# Altium schematic sheet POWER_SYS.SchDoc
size C; SheetNumber: 4; SheetTotal: 24
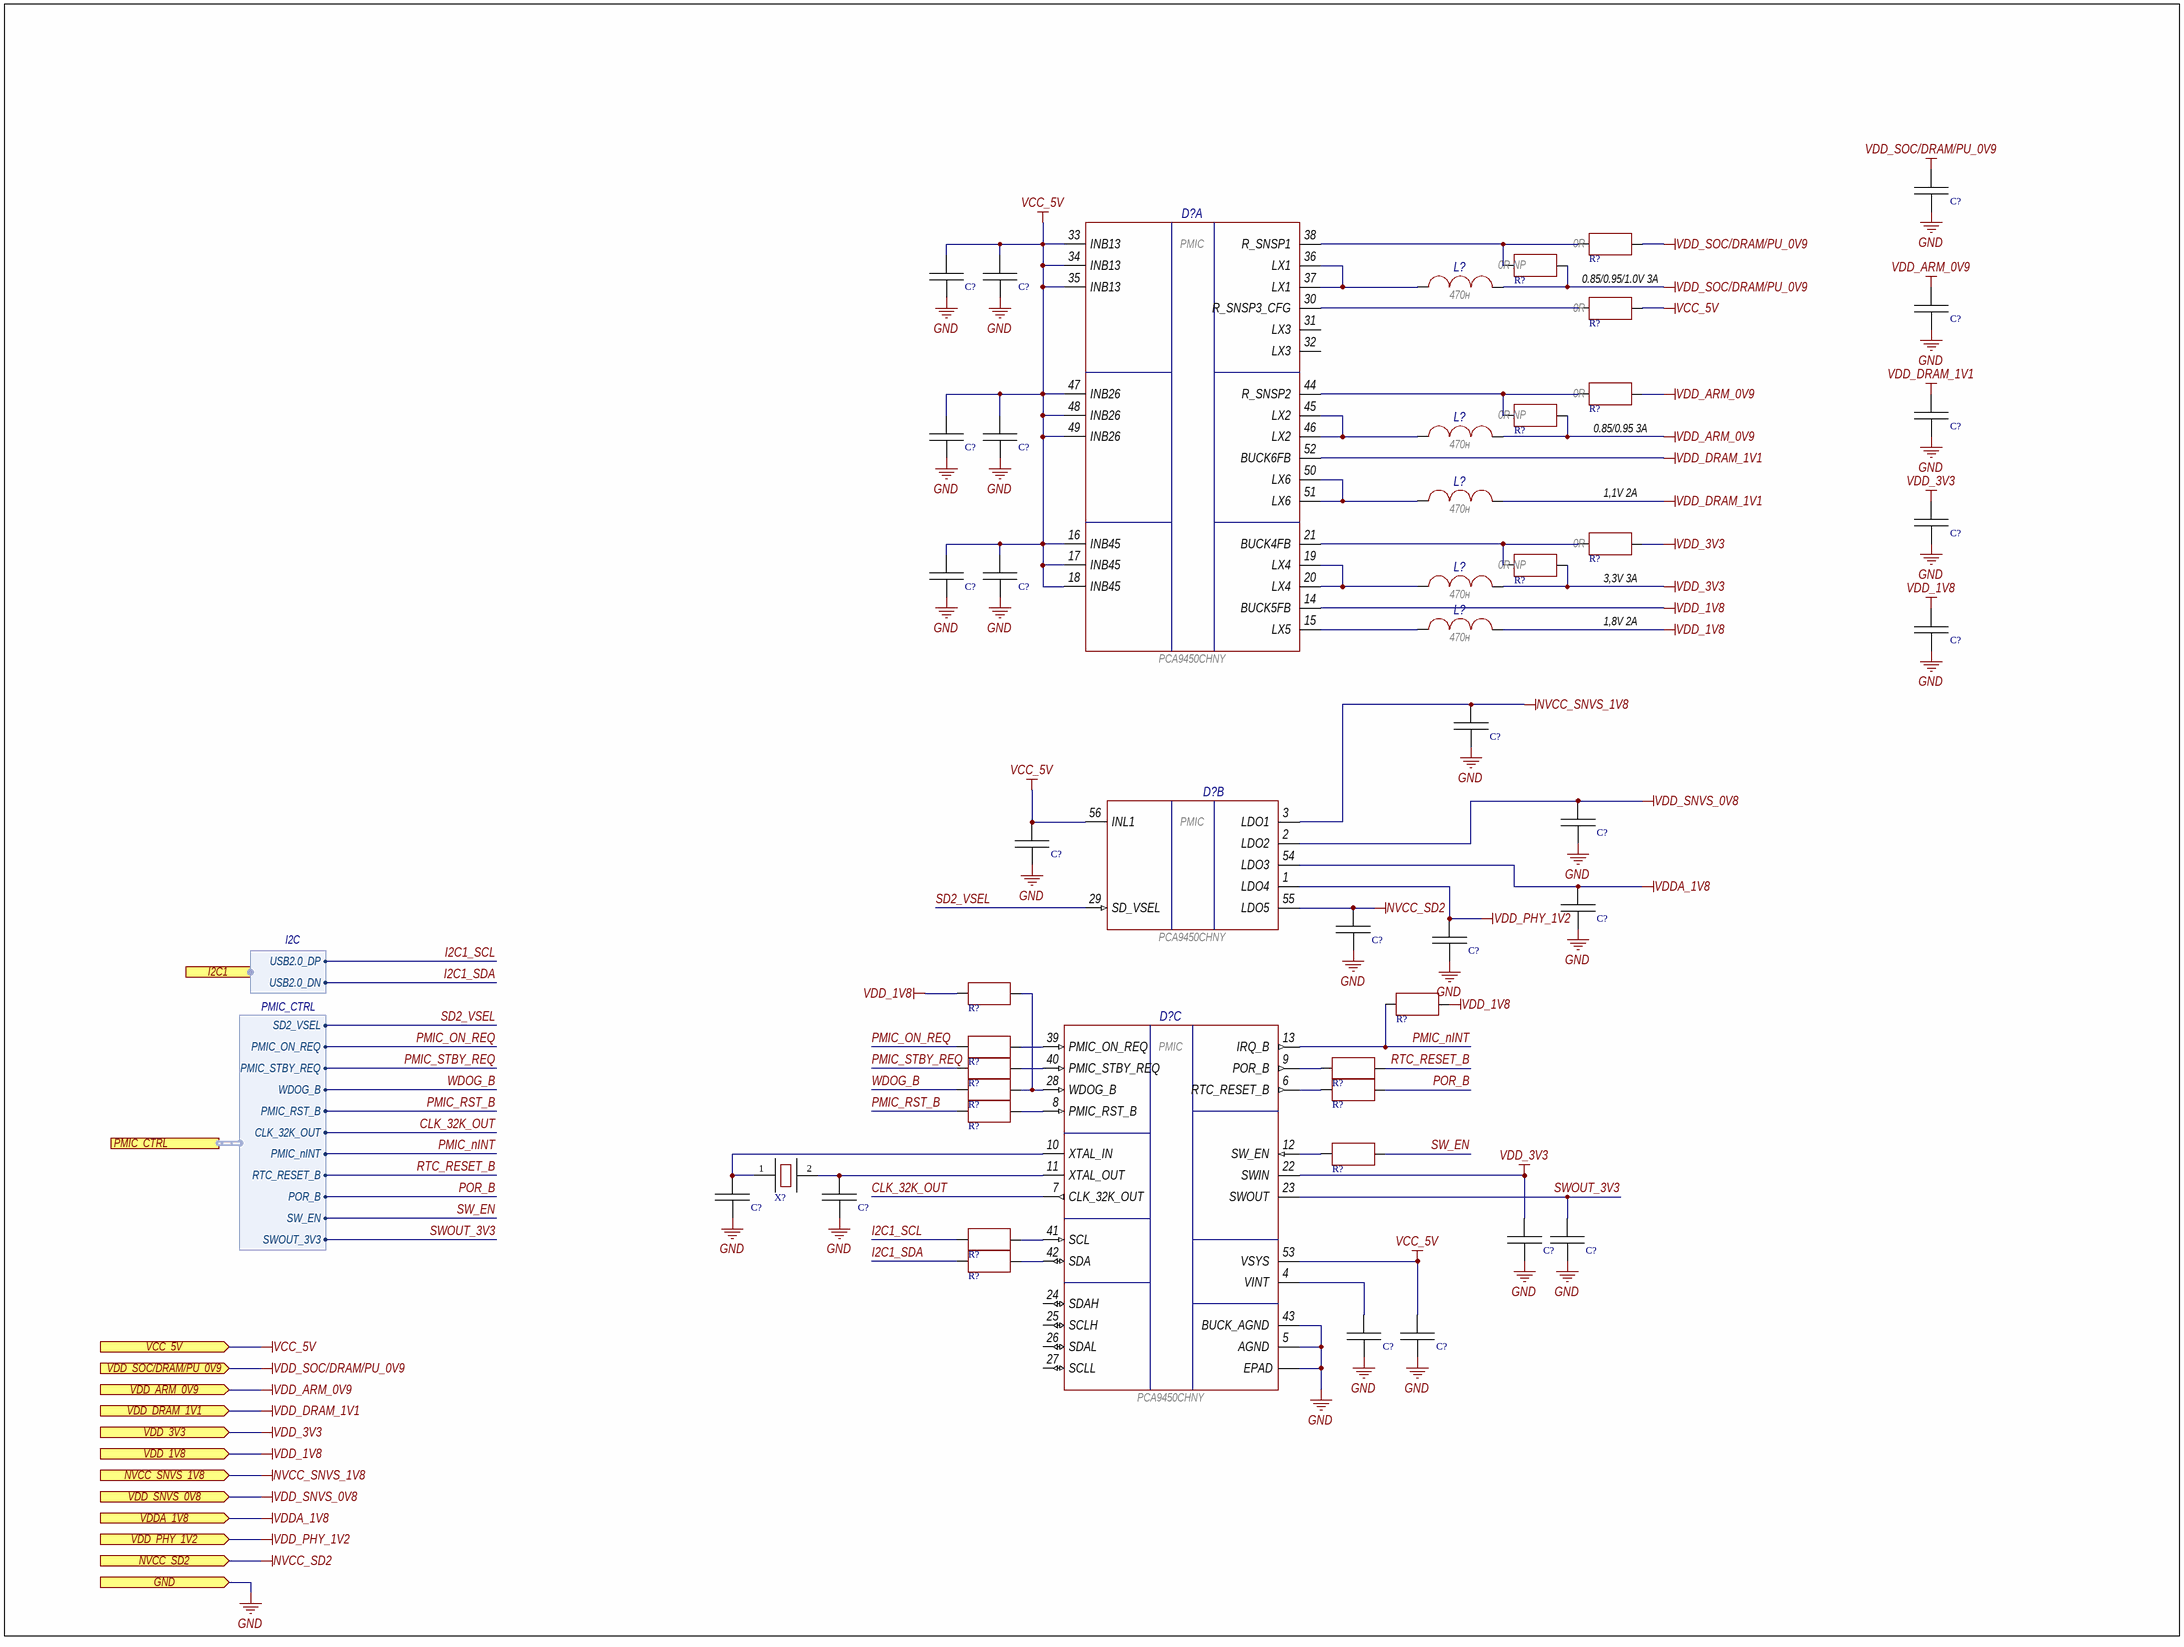
[diagram p0: POWER_SYS.SchDoc]

## Parts
(Parts that share a designator on the sheet are numbered #1, #2 ... from top to bottom, then left to right.)
C?#1  22uF  [C0805]  (value not drawn)
C?#2  10uF  [C0603]  (value not drawn)
C?#3  10uF  [C0603]  (value not drawn)
C?#4  22uF  [C0805]  (value not drawn)
C?#5  22uF  [C0805]  (value not drawn)
C?#6  10uF  [C0603]  (value not drawn)
C?#7  10uF  [C0603]  (value not drawn)
C?#8  22uF  [C0805]  (value not drawn)
C?#9  10uF  [C0603]  (value not drawn)
C?#10  10uF  [C0603]  (value not drawn)
C?#11  22uF  [C0805]  (value not drawn)
C?#12  1uF  [C0603]  (value not drawn)
C?#13  1uF  [C0603]  (value not drawn)
C?#14  4.7uF  [C0603]  (value not drawn)
C?#15  1uF  [C0603]  (value not drawn)
C?#16  1uF  [C0603]  (value not drawn)
C?#17  1uF  [C0603]  (value not drawn)
C?#18  12pF  [C0603]  (value not drawn)
C?#19  12pF  [C0603]  (value not drawn)
C?#20  1uF  [C0603]  (value not drawn)
C?#21  1uF  [C0603]  (value not drawn)
C?#22  1uF  [C0603]  (value not drawn)
C?#23  4.7uF  [C0603]  (value not drawn)
D?#1  PCA9450CHNY  [HVQFN56_7.0x7.0x1.0Body_4.7x4.7EP; Recommended: NXP]  (part A of 3)
D?#2  PCA9450CHNY  [HVQFN56_7.0x7.0x1.0Body_4.7x4.7EP; Recommended: NXP]  (part B of 3)
D?#3  PCA9450CHNY  [HVQFN56_7.0x7.0x1.0Body_4.7x4.7EP; Recommended: NXP]  (part C of 3)
L?#1  Значение: 470н  [SRU1048]  (hidden comment: SRP7028A-R47M)
L?#2  Значение: 470н  [SRU1048]  (hidden comment: SRP7028A-R47M)
L?#3  Значение: 470н  [SRU1048]  (hidden comment: SRP7028A-R47M)
L?#4  Значение: 470н  [SRU1048]  (hidden comment: SRP7028A-R47M)
L?#5  Значение: 470н  [SRU1048]  (hidden comment: SRP7028A-R47M)
R?#1  0R  [R0603]
R?#2  0R NP  [R0603]
R?#3  0R  [R0603]
R?#4  0R  [R0603]
R?#5  0R NP  [R0603]
R?#6  0R  [R0603]
R?#7  0R NP  [R0603]
R?#8  0R NP  [R0603]  (value not drawn)
R?#9  100k  [R0603]  (value not drawn)
R?#10  0R  [R0603]  (value not drawn)
R?#11  0R  [R0603]  (value not drawn)
R?#12  0R  [R0603]  (value not drawn)
R?#13  0R  [R0603]  (value not drawn)
R?#14  0R  [R0603]  (value not drawn)
R?#15  0R  [R0603]  (value not drawn)
R?#16  0R  [R0603]  (value not drawn)
R?#17  0R  [R0603]  (value not drawn)
R?#18  0R  [R0603]  (value not drawn)
X?  NX3215SA-32.768K-STD-MUA-8  [DFN3127P600-8N]  (value not drawn)

## Ports
GND (in), I2C1 (harness I2C), NVCC_SD2 (in), NVCC_SNVS_1V8 (in), PMIC_CTRL (harness PMIC_CTRL), VCC_5V (in), VDD_1V8 (in), VDD_3V3 (in), VDD_ARM_0V9 (in), VDD_DRAM_1V1 (in), VDD_PHY_1V2 (in), VDD_SNVS_0V8 (in), VDD_SOC/DRAM/PU_0V9 (in), VDDA_1V8 (in)

## Harnesses
PMIC_CTRL: PMIC_STBY_REQ, WDOG_B, CLK_32K_OUT, RTC_RESET_B, POR_B, PMIC_RST_B, PMIC_nINT, SW_EN, SD2_VSEL, PMIC_ON_REQ, SWOUT_3V3
I2C: USB2.0_DP, USB2.0_DN

## Nets
GND: C?#1.1 C?#2.1 C?#3.1 C?#4.1 C?#5.1 C?#6.1 C?#7.1 C?#8.1 C?#9.1 C?#10.1 C?#11.1 C?#12.1 C?#13.1 C?#14.1 C?#15.1 C?#16.1 C?#17.1 C?#18.1 C?#19.1 C?#20.1 C?#21.1 C?#22.1 C?#23.1 D?#3.5(AGND) D?#3.43(BUCK_AGND) D?#3.EPAD ; port GND
NVCC_SD2: C?#16.2 D?#2.55(LDO5) ; port NVCC_SD2
NVCC_SNVS_1V8: C?#12.2 D?#2.3(LDO1) ; port NVCC_SNVS_1V8
VCC_5V: C?#2.2 C?#3.2 C?#6.2 C?#7.2 C?#9.2 C?#10.2 C?#14.2 C?#23.2 D?#1.16(INB45) D?#1.17(INB45) D?#1.18(INB45) D?#1.33(INB13) D?#1.34(INB13) D?#1.35(INB13) D?#1.47(INB26) D?#1.48(INB26) D?#1.49(INB26) D?#2.56(INL1) D?#3.53(VSYS) R?#3.2 ; port VCC_5V
VDD_1V8: C?#11.2 D?#1.14(BUCK5FB) L?#5.2 R?#8.1 R?#9.2 ; port VDD_1V8
VDD_3V3: C?#8.2 C?#20.2 D?#3.22(SWIN) L?#4.2 R?#6.2 R?#7.2 ; port VDD_3V3
VDD_ARM_0V9: C?#4.2 L?#2.2 R?#4.2 R?#5.2 ; port VDD_ARM_0V9
VDD_DRAM_1V1: C?#5.2 D?#1.52(BUCK6FB) L?#3.2 ; port VDD_DRAM_1V1
VDD_PHY_1V2: C?#17.2 D?#2.1(LDO4) ; port VDD_PHY_1V2
VDD_SNVS_0V8: C?#13.2 D?#2.2(LDO2) ; port VDD_SNVS_0V8
VDD_SOC/DRAM/PU_0V9: C?#1.2 L?#1.2 R?#1.2 R?#2.2 ; port VDD_SOC/DRAM/PU_0V9
VDDA_1V8: C?#15.2 D?#2.54(LDO3) ; port VDDA_1V8
CLK_32K_OUT: D?#3.7(CLK_32K_OUT) ; port PMIC_CTRL.CLK_32K_OUT
I2C1_SCL: R?#17.1 ; port I2C1.USB2.0_DP
I2C1_SDA: R?#18.1 ; port I2C1.USB2.0_DN
PMIC_nINT: D?#3.13(IRQ_B) R?#9.1 ; port PMIC_CTRL.PMIC_nINT
PMIC_ON_REQ: R?#10.1 ; port PMIC_CTRL.PMIC_ON_REQ
PMIC_RST_B: R?#15.1 ; port PMIC_CTRL.PMIC_RST_B
PMIC_STBY_REQ: R?#11.1 ; port PMIC_CTRL.PMIC_STBY_REQ
POR_B: R?#14.2 ; port PMIC_CTRL.POR_B
RTC_RESET_B: R?#12.2 ; port PMIC_CTRL.RTC_RESET_B
SD2_VSEL: D?#2.29(SD_VSEL) ; port PMIC_CTRL.SD2_VSEL
SW_EN: R?#16.2 ; port PMIC_CTRL.SW_EN
SWOUT_3V3: C?#21.2 D?#3.23(SWOUT) ; port PMIC_CTRL.SWOUT_3V3
WDOG_B: R?#13.1 ; port PMIC_CTRL.WDOG_B
NetC?#18_2: C?#18.2 D?#3.10(XTAL_IN) X?.1(GND)
NetC?#19_2: C?#19.2 D?#3.11(XTAL_OUT) X?.2
NetC?#22_2: C?#22.2 D?#3.4(VINT)
NetD?#1_15: D?#1.15(LX5) L?#5.1
NetD?#1_19: D?#1.19(LX4) D?#1.20(LX4) L?#4.1
NetD?#1_21: D?#1.21(BUCK4FB) R?#6.1 R?#7.1
NetD?#1_30: D?#1.30(R_SNSP3_CFG) R?#3.1
NetD?#1_36: D?#1.36(LX1) D?#1.37(LX1) L?#1.1
NetD?#1_38: D?#1.38(R_SNSP1) R?#1.1 R?#2.1
NetD?#1_44: D?#1.44(R_SNSP2) R?#4.1 R?#5.1
NetD?#1_45: D?#1.45(LX2) D?#1.46(LX2) L?#2.1
NetD?#1_50: D?#1.50(LX6) D?#1.51(LX6) L?#3.1
NetD?#3_6: D?#3.6(RTC_RESET_B) R?#14.1
NetD?#3_8: D?#3.8(PMIC_RST_B) R?#15.2
NetD?#3_9: D?#3.9(POR_B) R?#12.1
NetD?#3_12: D?#3.12(SW_EN) R?#16.1
NetD?#3_28: D?#3.28(WDOG_B) R?#8.2 R?#13.2
NetD?#3_39: D?#3.39(PMIC_ON_REQ) R?#10.2
NetD?#3_40: D?#3.40(PMIC_STBY_REQ) R?#11.2
NetD?#3_41: D?#3.41(SCL) R?#17.2
NetD?#3_42: D?#3.42(SDA) R?#18.2

Not connected (* = marked no-connect by the designer): D?#1 31(LX3_) 32(LX3_); D?#3 24(SDAH_) 25(SCLH_) 26(SDAL_) 27(SCLL_)

## Notes on the sheet
- (near R?#2) 0.85/0.95/1.0V 3A
- (near R?#4) 0.85/0.95 3A
- (near R?#6) 1,1V 2A
- (near R?#6) 3,3V 3A
- 1,8V 2A
- Подп. дата
- Инв. № дубл.
- Взам. инв. №
- Подп. и дата
- Инв. № подл.
- Изм.
- Лист
- № докум.
- Подп.
- Дата
- ALTIUM GOSTBOM2.0 KEV
- Файл:
- Копировал
- Формат А3
- (in symbol VCH_CMP_IC_0000134-4, part A) PMIC
- (in symbol VCH_CMP_IC_0000134-4, part B) PMIC
- (in symbol VCH_CMP_IC_0000134-4, part C) PMIC

## Library data of the parts
C?#1 C?#4 C?#5 C?#8 C?#11 = Cap 22uF 10% 10V: Manufacture: Murata; Model: GRM21BR61A226ME51L; Tolerance: 10%; Voltage: 10V; HelpURL: https://www.electronshik.ru/item/MUR/GRM21BR61A226ME51L; Case: 0805; Value: 22uF; Part Number: GRM21BR61A226ME51L
C?#2 C?#3 C?#6 C?#7 C?#9 C?#10 = Cap 10uF 20% 10V: Manufacture: Yageo; Model: CC0603MRX5R6BB106; Tolerance: 20%; Voltage: 10V; HelpURL: https://www.digikey.com/en/products/detail/yageo/CC0603MRX5R6BB106/5195224; Case: 0603; Value: 10uF; Part Number: CC0603MRX5R6BB106
C?#12 C?#13 C?#15-C?#17 C?#20-C?#22 = Cap 1uF 10% 16V_AVX: Manufacture: AVX Corporation; Model: 0603YD105KAT2A; Tolerance: 10%; Voltage: 16V; HelpURL: https://www.digikey.com/en/products/detail/avx-corporation/0603YD105KAT2A/563359?s=N4IgTCBcDaICwHYAcBaAjGOBOFYUDkAREAXQF8g; Case: 0603; Value: 1uF; Part Number: 0603YD105KAT2A
C?#14 C?#23 = Cap 4.7uF 10% 10V: Manufacture: Yageo; Model: CC0603KRX5R6BB475; Tolerance: 10%; Voltage: 10V; HelpURL: https://www.electronshik.ru/item/YAG/CC0603KRX5R6BB475; Case: 0603; Value: 4.7uF; Part Number: CC0603KRX5R6BB475
C?#18 C?#19 = Cap 12pF 5% 50V: Manufacture: AVX Corporation; Model: 06035A120JAT2A; Tolerance: 5%; Voltage: 50V; HelpURL: https://www.digikey.com/products/en?keywords=478-1164-1-ND; Case: 0603; Value: 12pF; Part Number: 06035A120JAT2A
D?#1-D?#3 = VCH_CMP_IC_0000134-4: PCA9450C is companion PMIC for i.MX 8M Plus; Manufacturer: NXP; 1) Rθja: 32°C; 1) Ta max: 105°C; 1) Ta min: -40°C; 1) Tj max: 150°C; 2) Height max: 1mm; 2) Length max: 7mm; 3) Fsw max: 2MHz; 3) Iout max: 6A; 3) Vin max: 5.5V; 3) Vin min: 2.7V; 5) Package: HVQFN56; 6) LDO Number: 5; 6) Step-Down Number: 6; 6) Switch Number: 1; 7) Function: Buck, LDO, SW; 7) Synchronous Rectifier: y; 7) Topology: Buck; Part Number: PCA9450CHNY; 1) Tj min: -40°C; 2) Width max: 7mm
L?#1-L?#5 = VCH_CMP_IND_0000016-14: N/A; Manufacturer: Bourns; Value: 470nH; 1) Ta max: 150°C; 1) Ta min: -55°C; 2) Height max: 3mm; 2) Length max: 7mm; 2) Package: Molded; 4) Mounting: SMT; 4) Note: Power; 3) DCR max @25°C: 4.2m; 3) Irms @25°C: 17.2A; 3) Isat @25°C: 26A; 3) SRF nom @25°C: 80MHz; 3) Tolerance @25°C: 20%; 5) Core Material: Carbonyl Power; 5) Shielded: y; Part Number: SRP7028A-R47M; 2) Width max: 7mm; ComponentLink1Description: URL Manufacturer; ComponentLink1URL: https://www.bourns.com/products/magnetic-products/power-inductors-smd-high-current-shielded/product/SRP7028A
R?#1 R?#3 R?#4 R?#6 R?#10-R?#18 = Res 0R OHM 0603: Part Number: P0.0GDKR-ND; Manufacture: Panasonic Electronic Components; Tolerance: 5%; Model: ERJ-3GEY0R00V; HelpURL: https://www.digikey.com/en/products/detail/panasonic-electronic-components/ERJ-3GEY0R00V/577612; Case: 0603; Value: 0R
R?#2 R?#5 R?#7 R?#8 = Res 0R NP 1% 0603: Tolerance: 1%; Case: 0603; Value: 0R NP
R?#9 = Res 100k 1% 0603: Part Number: P100KHTR-ND; Manufacture: Panasonic Electronic Components; Tolerance: 1%; Model: ERJ-3EKF1003V; HelpURL: https://www.digikey.com/products/en?keywords=P100KHTR-ND; Case: 0603; Value: 100k
X? = NX3215SA-32.768K-STD-MUA-8: CRYSTAL 32.7680KHZ 12.5PF SMD; Manufacture: NDK America, Inc.; Case: XTAL321532X15MM; HelpURL: https://media.digikey.com/pdf/Data%20Sheets/NDK%20PDFs/NX3215SA-32.768K-STD-MUA-8.pdf; Model: NX3215SA-32.768K-STD-MUA-8; ComponentLink1Description: Datasheet; ComponentLink1URL: https://media.digikey.com/pdf/Data%20Sheets/NDK%20PDFs/NX3215SA-32.768K-STD-MUA-8.pdf